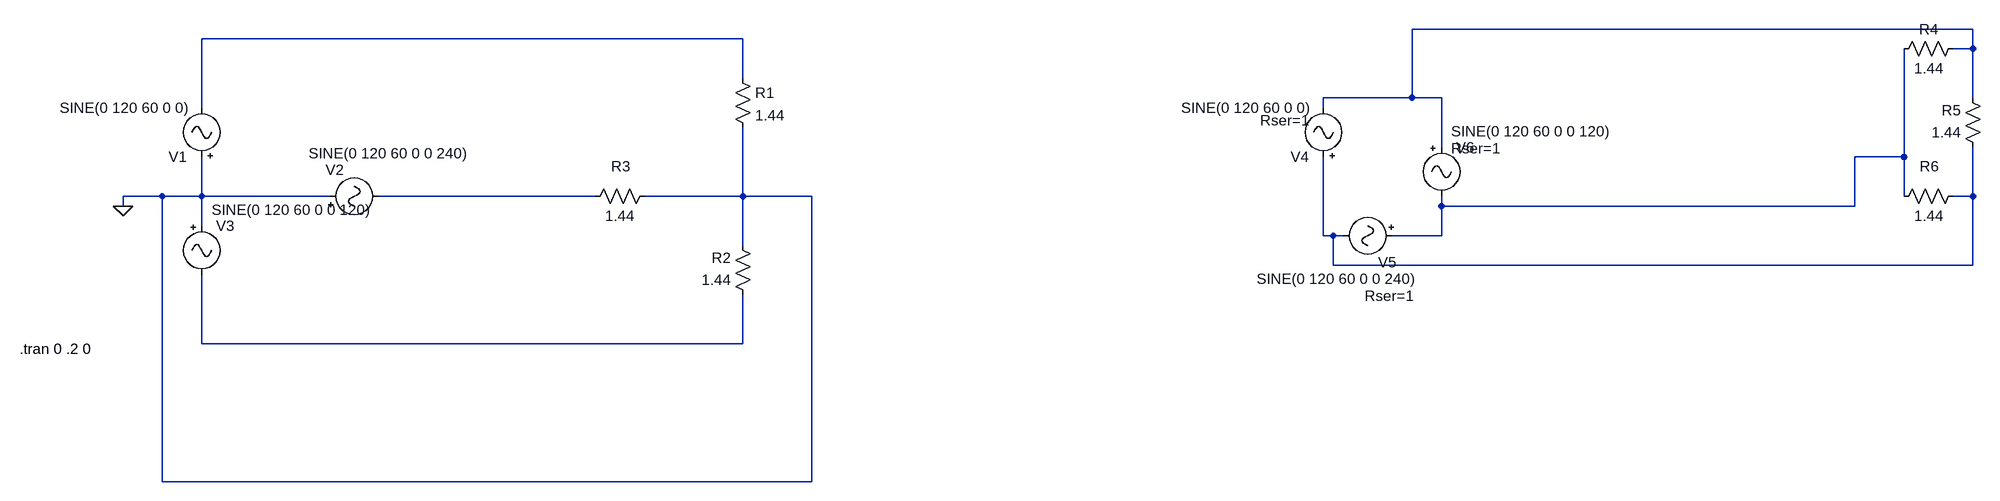
[diagram p0: schematic 3_Source_power_system.asc]
3_Source_power_system.asc, the LTspice schematic file:
Version 4.1
SHEET 1 3524 756
WIRE 2992 -16 2080 -16
WIRE 992 0 112 0
WIRE 2992 16 2992 -16
WIRE 2992 16 2960 16
WIRE 992 64 992 0
WIRE 2080 96 2080 -16
WIRE 2080 96 1936 96
WIRE 2128 96 2080 96
WIRE 2992 96 2992 16
WIRE 112 112 112 0
WIRE 1936 112 1936 96
WIRE 2128 176 2128 96
WIRE 2880 192 2880 16
WIRE 2880 192 2800 192
WIRE 48 256 -16 256
WIRE 112 256 112 192
WIRE 112 256 48 256
WIRE 320 256 112 256
WIRE 752 256 400 256
WIRE 992 256 992 144
WIRE 992 256 832 256
WIRE 1104 256 992 256
WIRE 2880 256 2880 192
WIRE 2992 256 2992 176
WIRE 2992 256 2960 256
WIRE -16 272 -16 256
WIRE 2128 272 2128 256
WIRE 2800 272 2800 192
WIRE 2800 272 2128 272
WIRE 112 304 112 256
WIRE 1936 320 1936 192
WIRE 1952 320 1936 320
WIRE 1968 320 1952 320
WIRE 2128 320 2128 272
WIRE 2128 320 2048 320
WIRE 992 336 992 256
WIRE 1952 368 1952 320
WIRE 2992 368 2992 256
WIRE 2992 368 1952 368
WIRE 112 496 112 384
WIRE 992 496 992 416
WIRE 992 496 112 496
WIRE 48 720 48 256
WIRE 1104 720 1104 256
WIRE 1104 720 48 720
FLAG -16 272 0
SYMBOL Misc\\signal 112 208 R180
WINDOW 123 0 0 Left 0
WINDOW 39 0 0 Left 0
SYMATTR InstName V1
SYMATTR Value SINE(0 120 60 0 0)
SYMBOL Misc\\signal 304 256 R270
WINDOW 0 43 10 VRight 2
WINDOW 3 70 -18 VRight 2
WINDOW 123 0 0 Left 0
WINDOW 39 0 0 Left 0
SYMATTR InstName V2
SYMATTR Value SINE(0 120 60 0 0 240)
SYMBOL Misc\\signal 112 288 R0
WINDOW 3 16 -10 Left 2
WINDOW 123 0 0 Left 0
WINDOW 39 0 0 Left 0
SYMATTR InstName V3
SYMATTR Value SINE(0 120 60 0 0 120)
SYMBOL res 976 48 R0
SYMATTR InstName R1
SYMATTR Value 1.44
SYMBOL res 1008 432 R180
WINDOW 0 36 76 Left 2
WINDOW 3 36 40 Left 2
SYMATTR InstName R2
SYMATTR Value 1.44
SYMBOL res 736 272 R270
WINDOW 0 49 57 VTop 2
WINDOW 3 0 56 VBottom 2
SYMATTR InstName R3
SYMATTR Value 1.44
SYMBOL Misc\\signal 1936 208 R180
WINDOW 123 0 0 Left 0
WINDOW 39 24 76 Left 2
SYMATTR InstName V4
SYMATTR Value SINE(0 120 60 0 0)
SYMATTR SpiceLine Rser=1
SYMBOL Misc\\signal 2064 320 R90
WINDOW 0 43 10 VRight 2
WINDOW 3 70 -18 VRight 2
WINDOW 123 0 0 Left 0
WINDOW 39 98 -18 VRight 2
SYMATTR InstName V5
SYMATTR Value SINE(0 120 60 0 0 240)
SYMATTR SpiceLine Rser=1
SYMBOL Misc\\signal 2128 160 R0
WINDOW 3 16 -10 Left 2
WINDOW 123 0 0 Left 0
WINDOW 39 16 18 Left 2
SYMATTR InstName V6
SYMATTR Value SINE(0 120 60 0 0 120)
SYMATTR SpiceLine Rser=1
SYMBOL res 2976 0 R90
WINDOW 0 0 56 VBottom 2
WINDOW 3 32 56 VTop 2
SYMATTR InstName R4
SYMATTR Value 1.44
SYMBOL res 3008 192 R180
WINDOW 0 36 76 Left 2
WINDOW 3 36 40 Left 2
SYMATTR InstName R5
SYMATTR Value 1.44
SYMBOL res 2864 272 R270
WINDOW 0 49 57 VTop 2
WINDOW 3 0 56 VBottom 2
SYMATTR InstName R6
SYMATTR Value 1.44
TEXT -184 504 Left 2 !.tran 0 .2 0

The netlist it stands for:
* 3_Source_power_system.asc
V1 0 N002 SINE(0 120 60 0 0)
V2 0 N004 SINE(0 120 60 0 0 240)
V3 0 N006 SINE(0 120 60 0 0 120)
R1 N002 0 1.44
R2 N006 0 1.44
R3 N004 0 1.44
V4 N005 N001 SINE(0 120 60 0 0) Rser=1
V5 N003 N005 SINE(0 120 60 0 0 240) Rser=1
V6 N001 N003 SINE(0 120 60 0 0 120) Rser=1
R4 N001 N003 1.44
R5 N005 N001 1.44
R6 N003 N005 1.44
.tran 0 .2 0
.backanno
.end